# EasyEDA schematic SCH_FluffelBot_Controller_2026-10-10.json
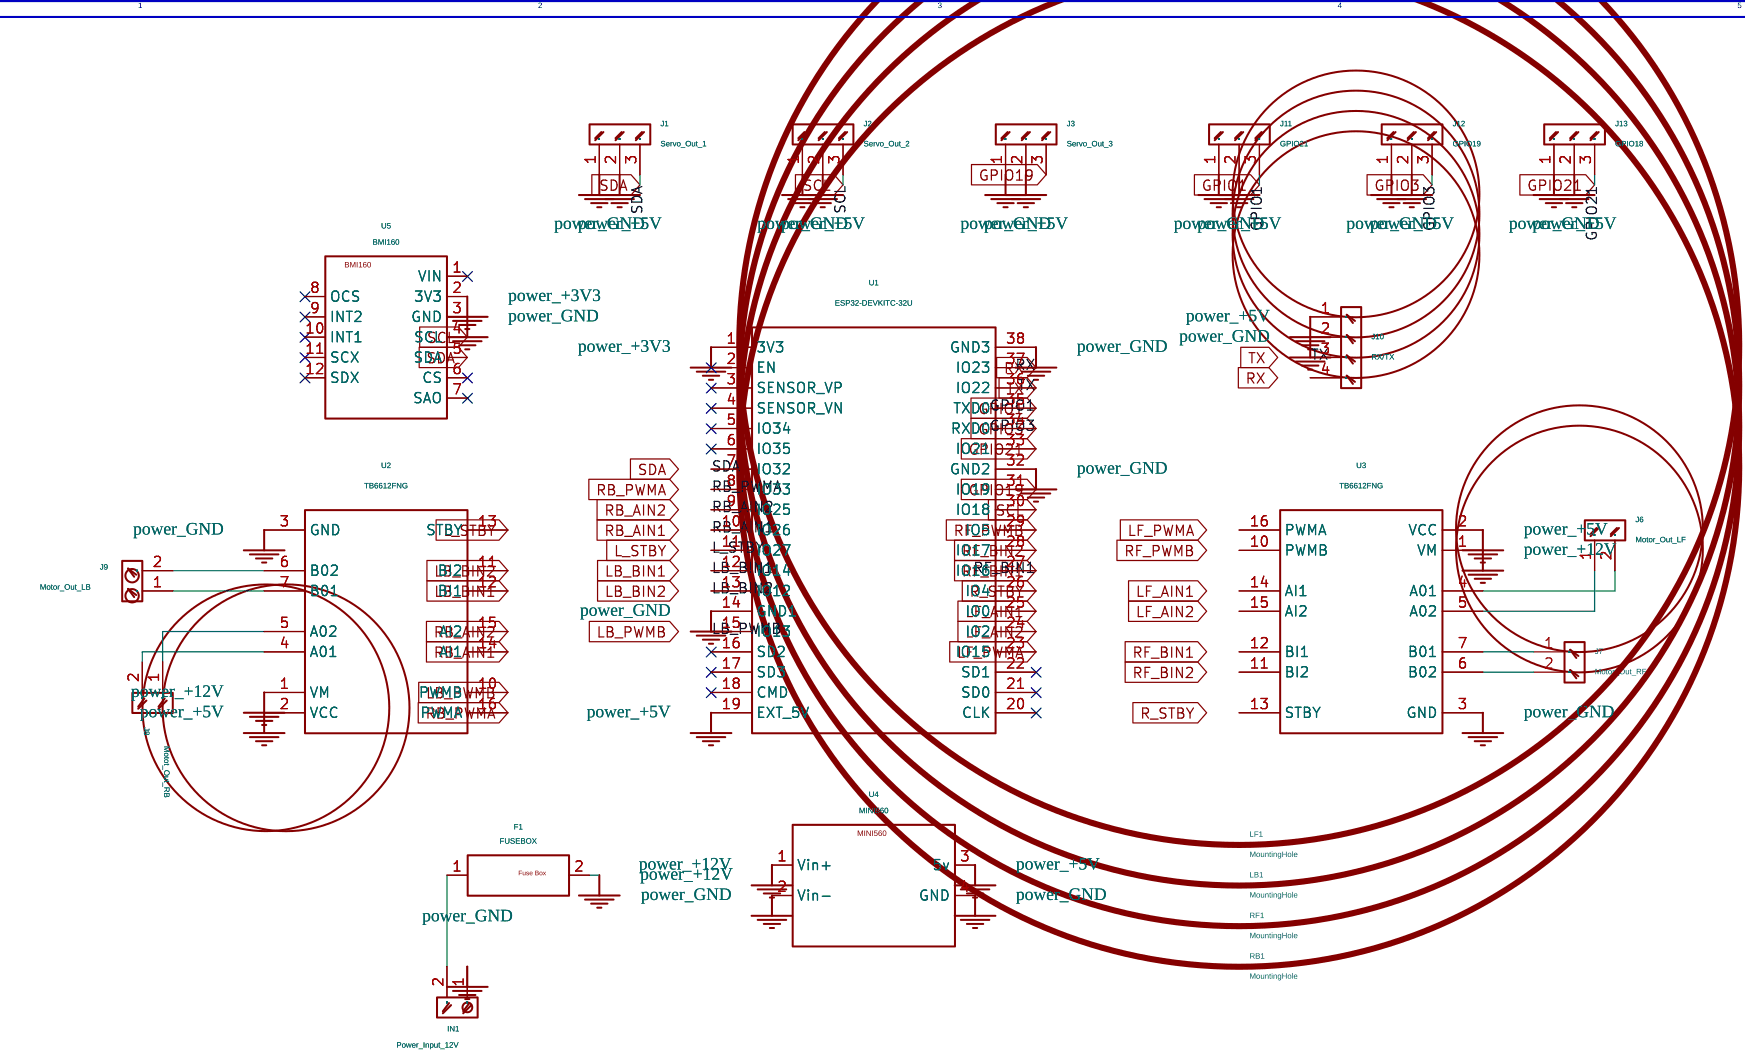
[diagram p0: schematic sheet]

## Parts
F1  FUSEBOX  [FUSEBOX:FUSEBOX]
IN1  Power_Input_12V  [KF301-2P:HANDSON_KF301-2P]
J1  Servo_Out_1  [B3B-XH-A_LF__SN_:JST_B3B-XH-A_LF__SN_]
J2  Servo_Out_2  [B3B-XH-A_LF__SN_:JST_B3B-XH-A_LF__SN_]
J3  Servo_Out_3  [B3B-XH-A_LF__SN_:JST_B3B-XH-A_LF__SN_]
J6  Motor_Out_LF  [KF301-2P:HANDSON_KF301-2P]
J7  Motor_Out_RF  [KF301-2P:HANDSON_KF301-2P]
J8  Motot_Out_RB  [KF301-2P:HANDSON_KF301-2P]
J9  Motor_Out_LB  [KF301-2P:HANDSON_KF301-2P]
J10  RX/TX  [CONNECTOR_PINHEADER_2.54MM:PINHEADER_1X04_P2.54MM_VERTICAL]
J11  GPIO21  [B3B-XH-A_LF__SN_:JST_B3B-XH-A_LF__SN_]
J12  GPIO19  [B3B-XH-A_LF__SN_:JST_B3B-XH-A_LF__SN_]
J13  GPIO18  [B3B-XH-A_LF__SN_:JST_B3B-XH-A_LF__SN_]
LB1  MountingHole  [MOUNTINGHOLE:MOUNTINGHOLE_3.2MM_M3]
LF1  MountingHole  [MOUNTINGHOLE:MOUNTINGHOLE_3.2MM_M3]
RB1  MountingHole  [MOUNTINGHOLE:MOUNTINGHOLE_3.2MM_M3]
RF1  MountingHole  [MOUNTINGHOLE:MOUNTINGHOLE_3.2MM_M3]
U1  ESP32-DEVKITC-32U  [ESP32-DEVKITC-32U:MODULE_ESP32-DEVKITC-32U]
U2  TB6612FNG  [TB6612FNG:MODULE_ROB-14450]
U3  TB6612FNG  [TB6612FNG:MODULE_ROB-14450]
U4  MINI560  [MINI560:MINI560]
U5  BMI160  [BMI160:BMI160]

## Library data of the parts
F1 = -: DeviceName: FUSEBOX:FUSEBOX; Origin Footprint: FUSEBOX:FUSEBOX; Add into BOM: yes; Convert to PCB: yes; Attribute1: FUSE BOX; PCB Layer: TopLayer; UniqueId: 09f31a4987c8a883; FootprintName: FUSEBOX:FUSEBOX
IN1 = -: Generic screw terminal, single row, 01x02, script generated (kicad-library-utils/schlib/autogen/connector/); DeviceName: KF301-2P:HANDSON_KF301-2P; Origin Footprint: KF301-2P:HANDSON_KF301-2P; Add into BOM: yes; Convert to PCB: yes; PCB Layer: TopLayer; UniqueId: 556c3393a6a85fd0; FootprintName: KF301-2P:HANDSON_KF301-2P
J1 = -: Generic screw terminal, single row, 01x03, script generated (kicad-library-utils/schlib/autogen/connector/); DeviceName: B3B-XH-A_LF__SN_:JST_B3B-XH-A_LF__SN_; Origin Footprint: B3B-XH-A_LF__SN_:JST_B3B-XH-A_LF__SN_; Add into BOM: yes; Convert to PCB: yes; PCB Layer: TopLayer; UniqueId: 51bfc0e5166a1c40; FootprintName: B3B-XH-A_LF__SN_:JST_B3B-XH-A_LF__SN_
J2 = -: Generic screw terminal, single row, 01x03, script generated (kicad-library-utils/schlib/autogen/connector/); DeviceName: B3B-XH-A_LF__SN_:JST_B3B-XH-A_LF__SN_; Origin Footprint: B3B-XH-A_LF__SN_:JST_B3B-XH-A_LF__SN_; Add into BOM: yes; Convert to PCB: yes; PCB Layer: TopLayer; UniqueId: 1fb9863844ab5169; FootprintName: B3B-XH-A_LF__SN_:JST_B3B-XH-A_LF__SN_
J3 = -: Generic screw terminal, single row, 01x03, script generated (kicad-library-utils/schlib/autogen/connector/); DeviceName: B3B-XH-A_LF__SN_:JST_B3B-XH-A_LF__SN_; Origin Footprint: B3B-XH-A_LF__SN_:JST_B3B-XH-A_LF__SN_; Add into BOM: yes; Convert to PCB: yes; PCB Layer: TopLayer; UniqueId: bd3ee0abdb58119f; FootprintName: B3B-XH-A_LF__SN_:JST_B3B-XH-A_LF__SN_
J6 = -: Generic screw terminal, single row, 01x02, script generated (kicad-library-utils/schlib/autogen/connector/); DeviceName: KF301-2P:HANDSON_KF301-2P; Origin Footprint: KF301-2P:HANDSON_KF301-2P; Add into BOM: yes; Convert to PCB: yes; PCB Layer: TopLayer; UniqueId: be1703a8306ee88a; FootprintName: KF301-2P:HANDSON_KF301-2P
J7 = -: Generic screw terminal, single row, 01x02, script generated (kicad-library-utils/schlib/autogen/connector/); DeviceName: KF301-2P:HANDSON_KF301-2P; Origin Footprint: KF301-2P:HANDSON_KF301-2P; Add into BOM: yes; Convert to PCB: yes; PCB Layer: TopLayer; UniqueId: adeb8d5268617f3b; FootprintName: KF301-2P:HANDSON_KF301-2P
J8 = -: Generic screw terminal, single row, 01x02, script generated (kicad-library-utils/schlib/autogen/connector/); DeviceName: KF301-2P:HANDSON_KF301-2P; Origin Footprint: KF301-2P:HANDSON_KF301-2P; Add into BOM: yes; Convert to PCB: yes; PCB Layer: TopLayer; UniqueId: 5c2e899d33916bcd; FootprintName: KF301-2P:HANDSON_KF301-2P
J9 = -: Generic screw terminal, single row, 01x02, script generated (kicad-library-utils/schlib/autogen/connector/); DeviceName: KF301-2P:HANDSON_KF301-2P; Origin Footprint: KF301-2P:HANDSON_KF301-2P; Add into BOM: yes; Convert to PCB: yes; PCB Layer: TopLayer; UniqueId: 14b2f8436ec73be4; FootprintName: KF301-2P:HANDSON_KF301-2P
J10 = -: Generic screw terminal, single row, 01x04, script generated (kicad-library-utils/schlib/autogen/connector/); DeviceName: Connector_PinHeader_2.54mm:PinHeader_1x04_P2.54mm_Vertical; Origin Footprint: Connector_PinHeader_2.54mm:PinHeader_1x04_P2.54mm_Vertical; Add into BOM: yes; Convert to PCB: yes; PCB Layer: TopLayer; UniqueId: 19810ed2731c20b4; FootprintName: Connector_PinHeader_2.54mm:PinHeader_1x04_P2.54mm_Vertical
J11 = -: Generic screw terminal, single row, 01x03, script generated (kicad-library-utils/schlib/autogen/connector/); DeviceName: B3B-XH-A_LF__SN_:JST_B3B-XH-A_LF__SN_; Origin Footprint: B3B-XH-A_LF__SN_:JST_B3B-XH-A_LF__SN_; Add into BOM: yes; Convert to PCB: yes; PCB Layer: TopLayer; UniqueId: d9503b6182e86bda; FootprintName: B3B-XH-A_LF__SN_:JST_B3B-XH-A_LF__SN_
J12 = -: Generic screw terminal, single row, 01x03, script generated (kicad-library-utils/schlib/autogen/connector/); DeviceName: B3B-XH-A_LF__SN_:JST_B3B-XH-A_LF__SN_; Origin Footprint: B3B-XH-A_LF__SN_:JST_B3B-XH-A_LF__SN_; Add into BOM: yes; Convert to PCB: yes; PCB Layer: TopLayer; UniqueId: 81192a87cd4e0892; FootprintName: B3B-XH-A_LF__SN_:JST_B3B-XH-A_LF__SN_
J13 = -: Generic screw terminal, single row, 01x03, script generated (kicad-library-utils/schlib/autogen/connector/); DeviceName: B3B-XH-A_LF__SN_:JST_B3B-XH-A_LF__SN_; Origin Footprint: B3B-XH-A_LF__SN_:JST_B3B-XH-A_LF__SN_; Add into BOM: yes; Convert to PCB: yes; PCB Layer: TopLayer; UniqueId: 4fb97ddf9141d37a; FootprintName: B3B-XH-A_LF__SN_:JST_B3B-XH-A_LF__SN_
LB1 = -: Mounting Hole without connection; DeviceName: MountingHole:MountingHole_3.2mm_M3; Origin Footprint: MountingHole:MountingHole_3.2mm_M3; Add into BOM: yes; Convert to PCB: yes; PCB Layer: TopLayer; UniqueId: 6c9d2313d9b7e05e; FootprintName: MountingHole:MountingHole_3.2mm_M3
LF1 = -: Mounting Hole without connection; DeviceName: MountingHole:MountingHole_3.2mm_M3; Origin Footprint: MountingHole:MountingHole_3.2mm_M3; Add into BOM: yes; Convert to PCB: yes; PCB Layer: TopLayer; UniqueId: dba04359f7c17f5a; FootprintName: MountingHole:MountingHole_3.2mm_M3
RB1 = -: Mounting Hole without connection; DeviceName: MountingHole:MountingHole_3.2mm_M3; Origin Footprint: MountingHole:MountingHole_3.2mm_M3; Add into BOM: yes; Convert to PCB: yes; PCB Layer: TopLayer; UniqueId: 0e978c3f30ebd6b7; FootprintName: MountingHole:MountingHole_3.2mm_M3
RF1 = -: Mounting Hole without connection; DeviceName: MountingHole:MountingHole_3.2mm_M3; Origin Footprint: MountingHole:MountingHole_3.2mm_M3; Add into BOM: yes; Convert to PCB: yes; PCB Layer: TopLayer; UniqueId: bc48224f46999aa0; FootprintName: MountingHole:MountingHole_3.2mm_M3
U1 = -: DeviceName: ESP32-DEVKITC-32U:MODULE_ESP32-DEVKITC-32U; MF: Espressif Systems; MAXIMUM_PACKAGE_HEIGHT: N/A; Price: None; Check_prices: https://www.snapeda.com/parts/ESP32-DEVKITC-32U/Espressif+Systems/view-part/?ref=eda; STANDARD: Manufacturer Recommendations; PARTREV: V4; SnapEDA_Link: https://www.snapeda.com/parts/ESP32-DEVKITC-32U/Espressif+Systems/view-part/?ref=snap; Description_1: ESP32-WROOM-32UE series Transceiver; 802.11 b/g/n (Wi-Fi, WiFi, WLAN), Bluetooth- Smart Ready 4.x Dual Mode Evaluation Board; Availability: In Stock; MANUFACTURER: Espressif Systems; Origin Footprint: ESP32-DEVKITC-32U:MODULE_ESP32-DEVKITC-32U; Add into BOM: yes; Convert to PCB: yes; PCB Layer: TopLayer; FootprintName: ESP32-DEVKITC-32U:MODULE_ESP32-DEVKITC-32U
U2 = -: DeviceName: TB6612FNG:MODULE_ROB-14450; MF: SparkFun Electronics; Description_1: TB6612FNG - Motor Controller/Driver Power Management Evaluation Board; Price: None; Check_prices: https://www.snapeda.com/parts/ROB-14450/SparkFun/view-part/?ref=eda; STANDARD: Manufacturer Recommendation; PARTREV: 11-13-17; SnapEDA_Link: https://www.snapeda.com/parts/ROB-14450/SparkFun/view-part/?ref=snap; MP: ROB-14450; Availability: In Stock; MANUFACTURER: Sparkfun Electronics; Origin Footprint: TB6612FNG:MODULE_ROB-14450; Add into BOM: yes; Convert to PCB: yes; PCB Layer: TopLayer; UniqueId: 48f0ae2437312dae; FootprintName: TB6612FNG:MODULE_ROB-14450
U3 = -: DeviceName: TB6612FNG:MODULE_ROB-14450; MF: SparkFun Electronics; Description_1: TB6612FNG - Motor Controller/Driver Power Management Evaluation Board; Price: None; Check_prices: https://www.snapeda.com/parts/ROB-14450/SparkFun/view-part/?ref=eda; STANDARD: Manufacturer Recommendation; PARTREV: 11-13-17; SnapEDA_Link: https://www.snapeda.com/parts/ROB-14450/SparkFun/view-part/?ref=snap; MP: ROB-14450; Availability: In Stock; MANUFACTURER: Sparkfun Electronics; Origin Footprint: TB6612FNG:MODULE_ROB-14450; Add into BOM: yes; Convert to PCB: yes; PCB Layer: TopLayer; UniqueId: 66797bcd97f4f6c2; FootprintName: TB6612FNG:MODULE_ROB-14450
U4 = -: DeviceName: MINI560:MINI560; Origin Footprint: MINI560:MINI560; Add into BOM: yes; Convert to PCB: yes; Attribute2: VIN+; Attribute3: VIN-; Attribute4: VOUT+; Attribute5: VOUT-; PCB Layer: TopLayer; UniqueId: bac468049775df37; FootprintName: MINI560:MINI560
U5 = -: DeviceName: BMI160:BMI160; Origin Footprint: BMI160:BMI160; Add into BOM: yes; Convert to PCB: yes; PCB Layer: TopLayer; UniqueId: adf583383e4d69d4; FootprintName: BMI160:BMI160

## Nets
GPIO1: J11.3(Pin) U1.35(TXD0)
GPIO3: J12.3(Pin) U1.34(RXD0)
GPIO19: U1.31(IO19)
GPIO21: J13.3(Pin) U1.33(IO21)
L_STBY: U1.11(IO27)
LB_BIN1: U1.12(IO14)
LB_BIN2: U1.13(IO12)
LB_PWMB: U1.15(IO13)
LF_AIN1: U1.25(IO0) U3.14(AI1)
LF_AIN2: U1.24(IO2) U3.15(AI2)
LF_PWMA: U1.23(IO15) U3.16(PWMA)
power_+3V3: U1.1(3V3) U5.2(3V3)
power_+5V: J1.2(Pin) J2.2(Pin) J3.2(Pin) J10.1(Pin) J11.2(Pin) J12.2(Pin) J13.2(Pin) U1.19(EXT_5V) U2.2(VCC) U3.2(VCC) U4.3(5v)
power_+12V: F1.2 U2.1(VM) U3.1(VM) U4.1(Vin+)
power_GND: IN1.1(Pin) J1.1(Pin) J2.1(Pin) J3.1(Pin) J10.2(Pin) J11.1(Pin) J12.1(Pin) J13.1(Pin) U1.14(GND1) U1.32(GND2) U1.38(GND3) U2.3(GND) U3.3(GND) U4.2(Vin-) U4.4(GND) U5.3(GND)
R_STBY: U1.26(IO4) U3.13(STBY)
RB_AIN1: U1.10(IO26)
RB_AIN2: U1.9(IO25)
RB_PWMA: U1.8(IO33)
RF_BIN1: U1.27(IO16) U3.12(BI1)
RF_BIN2: U1.28(IO17) U3.11(BI2)
RF_PWMB: U1.29(IO5) U3.10(PWMB)
RX: J10.4(Pin) U1.37(IO23)
SCL: J2.3(Pin) U1.30(IO18)
SDA: J1.3(Pin) U1.7(IO32)
TX: J10.3(Pin) U1.36(IO22)
Net-(F1-1): F1.1 IN1.2(Pin)
Net-(J6-1): J6.1(Pin) U3.5(A02)
Net-(J6-2): J6.2(Pin) U3.4(A01)
Net-(J7-1): J7.1(Pin) U3.7(B01)
Net-(J7-2): J7.2(Pin) U3.6(B02)
Net-(J8-1): J8.1(Pin) U2.5(A02)
Net-(J8-2): J8.2(Pin) U2.4(A01)
Net-(J9-1): J9.1(Pin) U2.7(B01)
Net-(J9-2): J9.2(Pin) U2.6(B02)

Not connected (* = marked no-connect by the designer): J3 3(Pin); U1 2(EN) 3(SENSOR_VP) 4(SENSOR_VN) 5(IO34) 6(IO35) 16(SD2) 17(SD3) 18(CMD) 20(CLK) 21(SD0) 22(SD1); U2 10(PWMB) 11(BI2) 12(BI1) 13(STBY) 14(AI1) 15(AI2) 16(PWMA); U5 1(VIN) 4(SCL) 5(SDA) 6(CS) 7(SAO) 8(OCS) 9(INT2) 10(INT1) 11(SCX) 12(SDX)

## Notes on the sheet
- 1
- 2
- 3
- 4
- 5
- 6
- A
- A
- B
- B
- C
- C
- D
- File:PCB_Transporter
- Sheet:/
- D
- Title:
- Size:"A4"
- Date:
- Rev:
- Id:/
- 1
- 2
- 3
- 4
- 5
- 6
